# EAGLE design TestBoard (EAGLE 9.6.2)
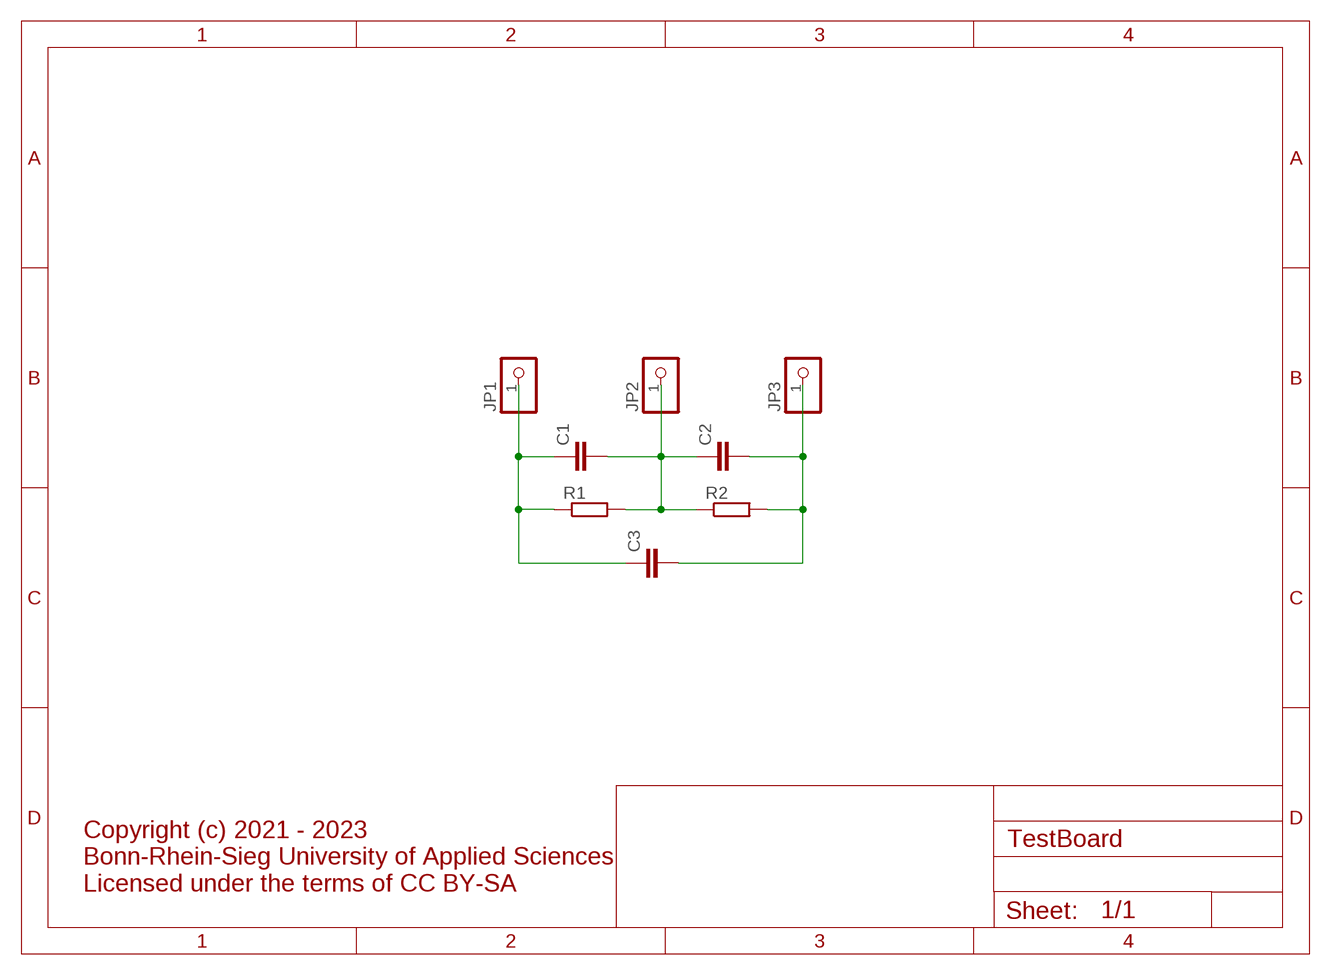
[diagram p0: schematic, sheet 1]

## Parts
C1  C-EUC0603  [C0603]
C2  C-EUC0603  [C0603]
C3  C-EUC0603  [C0603]
JP1  PINHD-1X1  [1X01]
JP2  PINHD-1X1  [1X01]
JP3  PINHD-1X1  [1X01]
R1  R-EU_R0603  [R0603]
R2  R-EU_R0603  [R0603]

## Nets
N$1: C1.1 C3.1 JP1.1 R1.1
N$2: C1.2 C2.1 JP2.1 R1.2 R2.1
N$3: C2.2 C3.2 JP3.1 R2.2

## Notes on the sheet
- Copyright (c) 2021 - 2023
  Bonn-Rhein-Sieg University of Applied Sciences
  Licensed under the terms of CC BY-SA

## Library data of the parts
C1-C3 = rcl:C-EU: CAPACITOR, European symbol
JP1-JP3 = pinhead:PINHD-1X1: PIN HEADER
R1 R2 = rcl:R-EU_: RESISTOR, European symbol

## Board
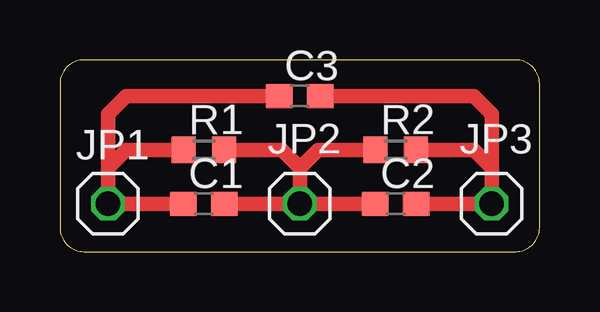
[diagram p1: board, top side]

Size 20 x 8 mm. Coordinates in mm from the lower left corner, seen from the top.
Outline: 1,0 19,0 arc90 20,1 20,7 arc90 19,8 1,8 arc90 0,7 0,1 arc90 1,0
Copper layers (1*16): Top 0.035mm / dielectric 1.5mm / Bottom 0.035mm
Design rules "PCB-POOL Standard": minimum track width 0.15mm, minimum drill 0.3mm, track to track 0.15mm, track to pad 0.15mm, pad to pad 0.15mm, via to via 0.15mm, smd to smd 0.15mm, copper to edge 0.3mm, drill to drill 0.2mm, minimum pad ring 0.2mm, minimum via ring 0.15mm, stop-mask expansion 0.075mm, vias tented up to drill 0mil, thermal gap 0.2mm

### Footprints (pad centres in the part's own frame; a part is rotated, then mirrored left to right if it is on the bottom)
C0603 = smd 1.1 x 1: 1 -0.85,0; 2 0.85,0
1X01 = drill 1.016 octagon: 1 0,0
R0603 = smd 1 x 1.1: 1 -0.85,0; 2 0.85,0

### Placement (x,y rotation side)
C1  6,2 0 top
C2  14,2 0 top
C3  10,6.5 0 top
JP1  2,2 0 top
JP2  10,2 0 top
JP3  18,2 0 top
R1  6,4.25 0 top
R2  14,4.25 0 top

### Tracks (layer width: path | path; a pad name or v marks a point on that pad's centre or on a via)
N$1
  Top 0.61: C1.1 JP1.1 2,3.5 | 2,3.5 2.75,4.25 R1.1 | C3.1 2.75,6.5 2,5.75 2,3.5
N$2
  Top 0.61: C1.2 JP2.1 | C2.1 JP2.1 | 10,3.5 9.25,4.25 R1.2 | JP2.1 10,3.5 | 10,3.5 10.75,4.25 R2.1
N$3
  Top 0.61: C2.2 JP3.1 18,3.5 | R2.2 17.25,4.25 18,3.5 | C3.2 17.25,6.5 18,5.75 18,3.5